# Altium schematic sheet Memory_SDRAM.SchDoc
size A
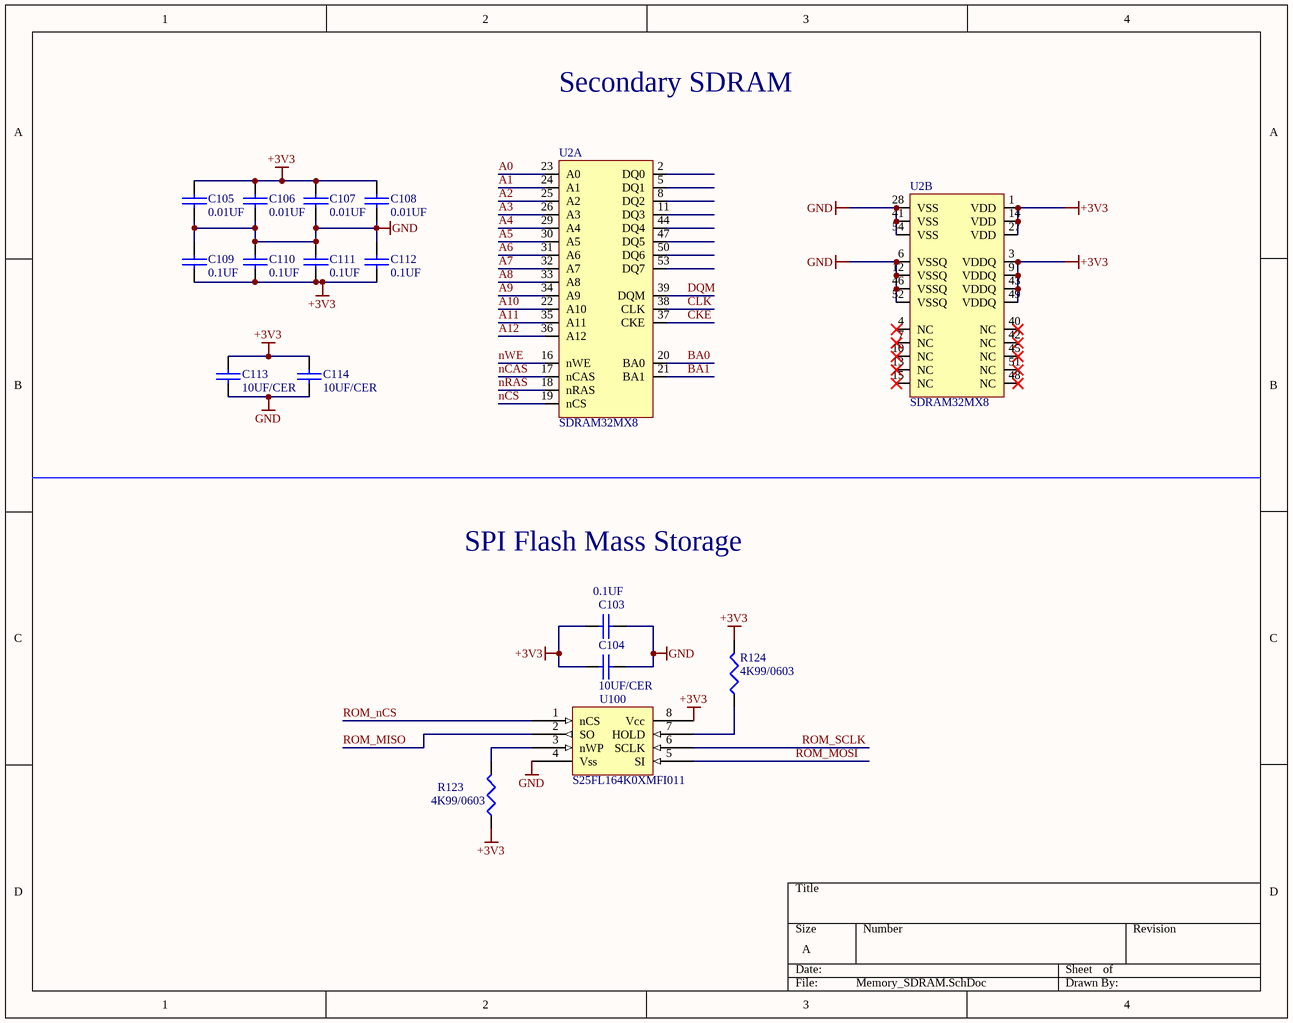
[diagram p0: Memory_SDRAM.SchDoc]

## Parts
C103  0.1UF  [0603]
C104  10UF/CER  [0805]
C105  0.01UF  [0603]
C106  0.01UF  [0603]
C107  0.01UF  [0603]
C108  0.01UF  [0603]
C109  0.1UF  [0603]
C110  0.1UF  [0603]
C111  0.1UF  [0603]
C112  0.1UF  [0603]
C113  10UF/CER  [0805]
C114  10UF/CER  [0805]
R123  4K99/0603  [0603]
R124  4K99/0603  [0603]
U2  SDRAM32MX8  [SOP54]  (parts A,B of 2)
U100  S25FL164K0XMFI011  [SO-8]

## Nets
+3V3: C103.1 C104.1 C105.1 C106.1 C107.1 C108.1 C109.2 C110.2 C111.2 C112.2 C113.2 C114.2 R123.1 R124.2 U2.1(VDD) U2.3(VDDQ) U2.9(VDDQ) U2.14(VDD) U2.27(VDD) U2.43(VDDQ) U2.49(VDDQ) U100.8(Vcc)
GND: C103.2 C104.2 C105.2 C106.2 C107.2 C108.2 C109.1 C110.1 C111.1 C112.1 C113.1 C114.1 U2.6(VSSQ) U2.12(VSSQ) U2.28(VSS) U2.41(VSS) U2.46(VSSQ) U2.52(VSSQ) U2.54(VSS) U100.4(Vss)
A0: U2.23(A0)
A1: U2.24(A1)
A2: U2.25(A2)
A3: U2.26(A3)
A4: U2.29(A4)
A5: U2.30(A5)
A6: U2.31(A6)
A7: U2.32(A7)
A8: U2.33(A8)
A9: U2.34(A9)
A10: U2.22(A10)
A11: U2.35(A11)
A12: U2.36(A12)
BA0: U2.20(BA0)
BA1: U2.21(BA1)
CKE: U2.37(CKE)
CLK: U2.38(CLK)
DQM: U2.39(DQM)
nCAS: U2.17(nCAS)
nCS: U2.19(nCS)
nRAS: U2.18(nRAS)
nWE: U2.16(nWE)
ROM_MISO: U100.2(SO)
ROM_MOSI: U100.5(SI)
ROM_nCS: U100.1(nCS)
ROM_SCLK: U100.6(SCLK)
NetR123_2: R123.2 U100.3(nWP)
NetR124_1: R124.1 U100.7(HOLD)

Not connected (* = marked no-connect by the designer): U2 2(DQ0) 4(NC)* 5(DQ1) 7(NC)* 8(DQ2) 10(NC)* 11(DQ3) 13(NC)* 15(NC)* 40(NC)* 42(NC)* 44(DQ4) 45(NC)* 47(DQ5) 48(NC)* 50(DQ6) 51(NC)* 53(DQ7)

## Notes on the sheet
- Secondary SDRAM
- SPI Flash Mass Storage

## Library data of the parts
C103 C109-C112 = 0.1UF: CAP .10UF 16V CERAMIC X7R 0603; MFG: Kemet; MFG PN: C0603C104K4RACTU; DK PN: 399-1096-1-ND; Price: 1.17
C104 C113 C114 = 10UF/CER: 10µF ±10% 25V Ceramic Capacitor X7S 0805; Text Field1: Murata; Text Field2: GRM21BC71E106KE11L; Text Field3: 490-10496-1-ND
C105-C108 = 0.01UF: 10000pF ±10% 10V Ceramic Capacitor X7R 0603 (1608 Metric); MFG: Kemet; MFG PN: C0603C103K8RACTU; DK PN: 399-11132-1-ND; Price: 1.17
R123 R124 = 4K99/0603: RES 4.99K OHM 1/10W 1% 0603 SMD; MFG: Dale/Vishay; MFG PN: CRCW06034K99FKEAC; DK PN: 541-3985-1-ND; Price: 5.02
U2 = SDRAM32MX8: SDRAM Memory IC 256Mb (32M x 8) Parallel 166MHz 5.5ns 54-TSOP II; MFG: Alliance Memory; MFG PN: AS4C32M8SA-6TIN; DK PN: 1450-1440-ND
U100 = S25FL164K0XMFI011: IC FLASH 64MBIT 108MHZ 8SOIC; Text Field1: Cyoress; Text Field3: 1274-1097-ND; Text Field2: S25FL164K0XMFI011